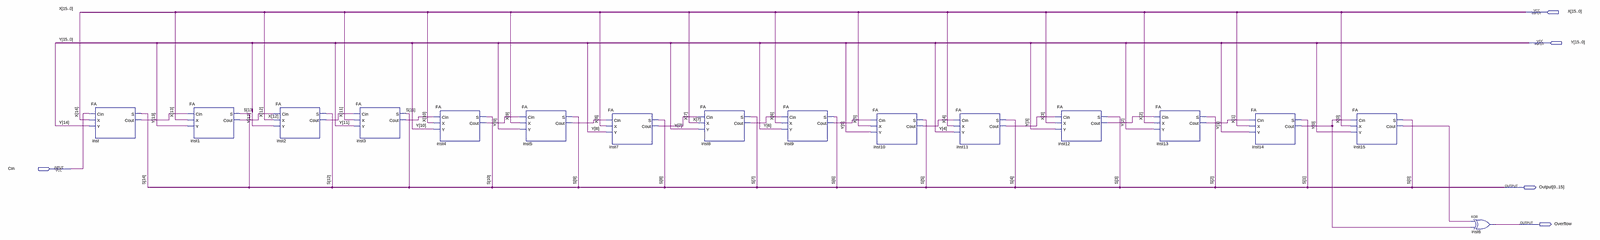
[diagram p0: schematic sheet, whole]
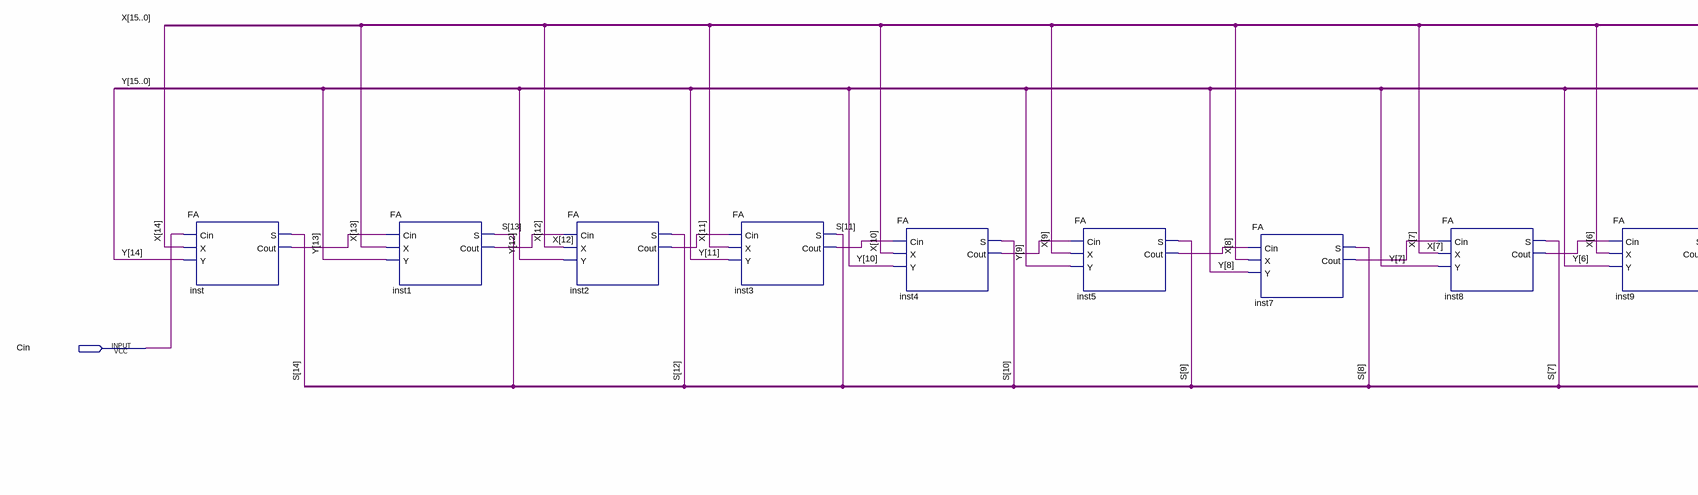
[diagram p1: schematic sheet, left part]
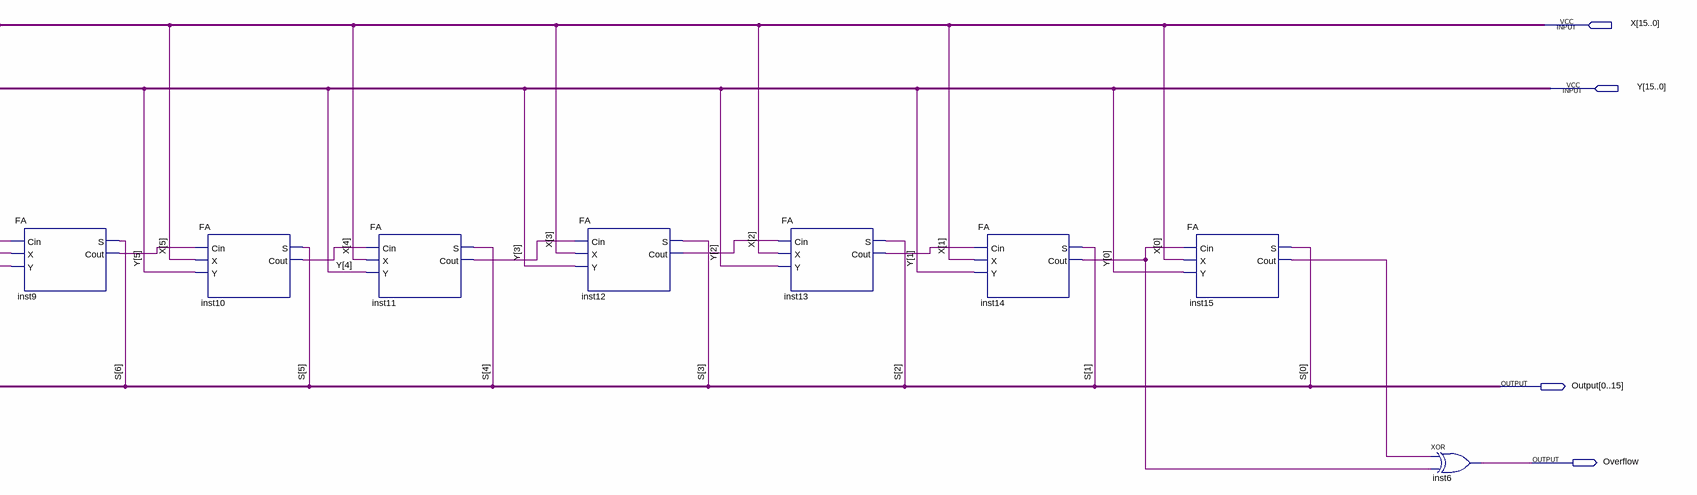
[diagram p2: schematic sheet, right part]
// Quartus schematic Adder.bdf as structural Verilog: 16 symbols, 5 pins
module Adder (
  input  [15:0] X,
  input  [15:0] Y,
  input  Cin,
  output [0:15] Output,
  output Overflow
);

  wire inst1_cout, inst2_cout, inst3_cout, inst4_cout, inst5_cout, inst7_cout, inst8_cout, inst9_cout,
       inst10_cout, inst11_cout, inst12_cout, inst13_cout, inst14_cout, inst15_cout, inst_cout;
  wire [14:0] S;

  FA inst (.Cin(Cin), .X(X[14]), .Y(Y[14]), .S(S[14]), .Cout(inst_cout));
  FA inst1 (.Cin(inst_cout), .X(X[13]), .Y(Y[13]), .S(S[13]), .Cout(inst1_cout));
  FA inst2 (.Cin(inst1_cout), .X(X[12]), .Y(Y[12]), .S(S[12]), .Cout(inst2_cout));
  FA inst3 (.Cin(inst2_cout), .X(X[11]), .Y(Y[11]), .S(S[11]), .Cout(inst3_cout));
  FA inst4 (.Cin(inst3_cout), .X(X[10]), .Y(Y[10]), .S(S[10]), .Cout(inst4_cout));
  FA inst5 (.Cin(inst4_cout), .X(X[9]), .Y(Y[9]), .S(S[9]), .Cout(inst5_cout));
  FA inst7 (.Cin(inst5_cout), .X(X[8]), .Y(Y[8]), .S(S[8]), .Cout(inst7_cout));
  FA inst8 (.Cin(inst7_cout), .X(X[7]), .Y(Y[7]), .S(S[7]), .Cout(inst8_cout));
  FA inst9 (.Cin(inst8_cout), .X(X[6]), .Y(Y[6]), .S(S[6]), .Cout(inst9_cout));
  FA inst10 (.Cin(inst9_cout), .X(X[5]), .Y(Y[5]), .S(S[5]), .Cout(inst10_cout));
  FA inst11 (.Cin(inst10_cout), .X(X[4]), .Y(Y[4]), .S(S[4]), .Cout(inst11_cout));
  FA inst12 (.Cin(inst11_cout), .X(X[3]), .Y(Y[3]), .S(S[3]), .Cout(inst12_cout));
  FA inst13 (.Cin(inst12_cout), .X(X[2]), .Y(Y[2]), .S(S[2]), .Cout(inst13_cout));
  FA inst14 (.Cin(inst13_cout), .X(X[1]), .Y(Y[1]), .S(S[1]), .Cout(inst14_cout));
  FA inst15 (.Cin(inst14_cout), .X(X[0]), .Y(Y[0]), .S(S[0]), .Cout(inst15_cout));
  xor inst6 (Overflow, inst15_cout, inst14_cout);
endmodule
